# EAGLE design GearIndicator_disp (EAGLE 7.1.0)
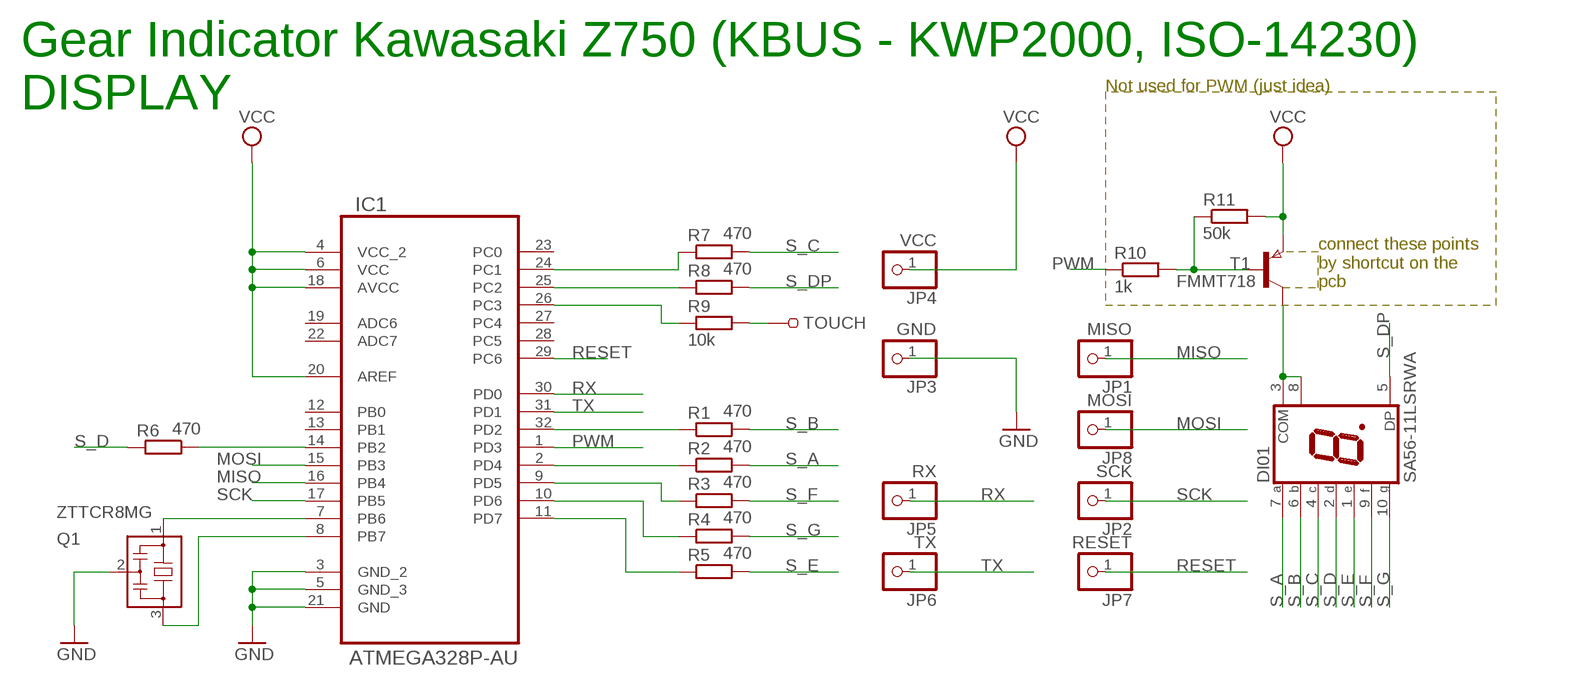
[diagram p0: schematic, sheet 1]

## Parts
DI01  SA56-11LSRWA  7-SEG_SA56-11  [SA56-11]
IC1  ATMEGA328P-AU  [QFP80P900X900X120-32N]
JP1  MISO  PIN1  [PIN1]
JP2  SCK  PIN1  [PIN1]
JP3  GND  PIN1  [PIN1]
JP4  VCC  PIN1  [PIN1]
JP5  RX  PIN1  [PIN1]
JP6  TX  PIN1  [PIN1]
JP7  RESET  PIN1  [PIN1]
JP8  MOSI  PIN1  [PIN1]
Q1  ZTTCR8MG  ZTTCR  [ZTTCR]
R1  470  R-EU_R0603  [R0603]
R2  470  R-EU_R0603  [R0603]
R3  470  R-EU_R0603  [R0603]
R4  470  R-EU_R0603  [R0603]
R5  470  R-EU_R0603  [R0603]
R6  470  R-EU_R0603  [R0603]
R7  470  R-EU_R0603  [R0603]
R8  470  R-EU_R0603  [R0603]
R9  10k  R-EU_R0603  [R0603]
R10  1k  R-EU_R0603  [R0603]
R11  50k  R-EU_R0603  [R0603]
T1  FMMT718  [SOT-23]
TOUCH  SMD1  [SMD_2X2]

## Nets
GND: IC1.3(GND_2) IC1.5(GND_3) IC1.21(GND) JP3.1 Q1.2
MISO: IC1.16(PB4) JP1.1
MOSI: IC1.15(PB3) JP8.1
N$1: IC1.7(PB6) Q1.1
N$2: IC1.8(PB7) Q1.3
N$3: DI01.3(COM) DI01.8(COM) T1.1(C)
N$4: IC1.24(PC1) R7.1
N$5: IC1.25(PC2) R8.1
N$6: IC1.11(PD7) R5.1
N$7: IC1.14(PB2) R6.1
N$8: IC1.32(PD2) R1.1
N$9: IC1.2(PD4) R2.1
N$10: IC1.9(PD5) R3.1
N$11: R10.2 R11.1 T1.3(B)
N$12: IC1.26(PC3) R9.1
N$13: R9.2 TOUCH.P$1
N$16: IC1.10(PD6) R4.1
PWM: IC1.1(PD3) R10.1
RESET: IC1.29(PC6) JP7.1
RX: IC1.30(PD0) JP5.1
S_A: DI01.7(A) R2.2
S_B: DI01.6(B) R1.2
S_C: DI01.4(C) R7.2
S_D: DI01.2(D) R6.2
S_DP: DI01.5(DP) R8.2
S_E: DI01.1(E) R5.2
S_F: DI01.9(F) R3.2
S_G: DI01.10(G) R4.2
SCK: IC1.17(PB5) JP2.1
TX: IC1.31(PD1) JP6.1
VCC: IC1.4(VCC_2) IC1.6(VCC) IC1.18(AVCC) IC1.20(AREF) JP4.1 R11.2 T1.2(E)
Unconnected: IC1.12(PB0) IC1.13(PB1) IC1.19(ADC6) IC1.22(ADC7) IC1.23(PC0) IC1.27(PC4) IC1.28(PC5)

## Notes on the sheet
- Not used for PWM (just idea)
- Gear Indicator Kawasaki Z750 (KBUS - KWP2000, ISO-14230)
  DISPLAY
- connect these points
  by shortcut on the
  pcb

## Library data of the parts
DI01 = display-kingbright:7-SEG_: Kingbright 14.2mm (0.56 INCH) SINGLE DIGIT NUMERIC DUISPLAY Source: SA56-11EWA(Ver1189471036.pdf; OC_FARNELL: unknown; OC_NEWARK: unknown
IC1 = Atmel_By_element14_Batch_1:ATMEGA328P-AU: 8-bit Microcontroller with In-System Programmable Flash; MPN: ATMEGA328P-AU; OC_FARNELL: 1715486; OC_NEWARK: 14R4631; PACKAGE: TQFP-32; SUPPLIER: Atmel
JP1-JP8 = pinhead:PIN1
Q1 = murata-filter:ZTTCR
R1-R11 = resistor:R-EU_: RESISTOR, European symbol
T1 = zetex:FMMT7*: PNP SILICON POWER (SWITCHING) TRANSISTORS SuperSOT Source: http://www.zetex.com/3.0/pdf/FMMT717.pdf; MPN: FMMT718; OC_FARNELL: 9526463RL; OC_NEWARK: 96K9968
TOUCH = pinhead:SMD1

## Board
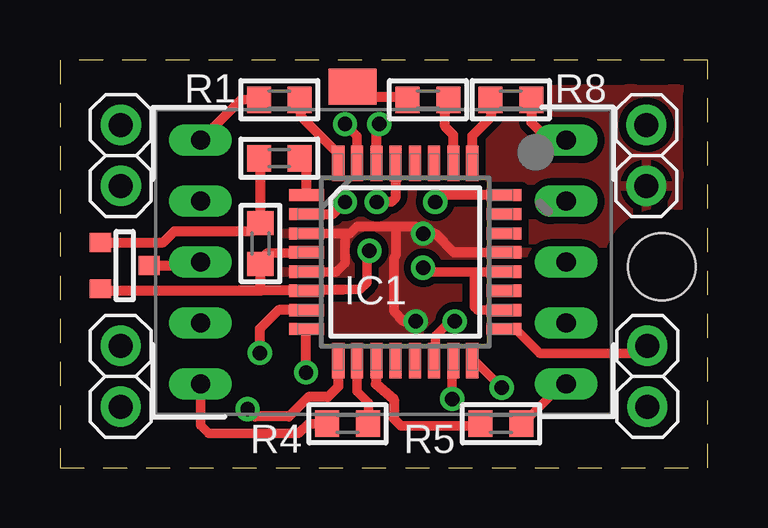
[diagram p1: board, top side]
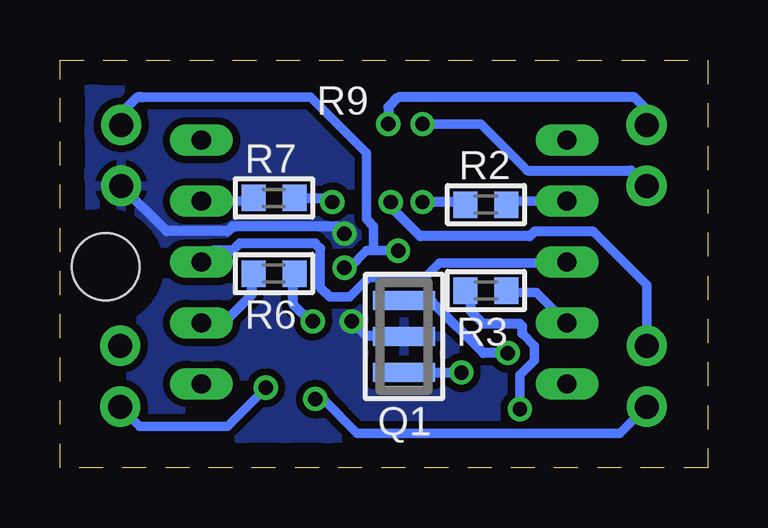
[diagram p2: board, bottom side, seen from below]

Size 27 x 17 mm. Coordinates in mm from the lower left corner, seen from the top.
Outline: 27,17 0,17 0,0 27,0 27,17
Copper layers (1*16): Top 0.035mm / dielectric 1.5mm / Bottom 0.035mm
Design rules "kawasaki": minimum track width 0.4mm, minimum drill 0.6mm, track to track 0.3mm, track to pad 0.3mm, pad to pad 0.3mm, via to via 0.3mm, smd to smd 0.3mm, copper to edge 40mil, drill to drill 8mil, minimum pad ring 10mil, minimum via ring 8mil, stop-mask expansion 4mil, vias tented up to drill 0mil, thermal gap 10mil
Holes 2.8 mm at 25.1,8.38

### Footprints (pad centres in the part's own frame; a part is rotated, then mirrored left to right if it is on the bottom)
SA56-11 = drill 0.8 long: 1 -5.08,-7.62; 2 -2.54,-7.62; 3 0,-7.62; 4 2.54,-7.62; 5 5.08,-7.62; 6 5.08,7.62; 7 2.54,7.62; 8 0,7.62; 9 -2.54,7.62; 10 -5.08,7.62
QFP80P900X900X120-32N = smd 1.473 x 0.508: 1 -4.115,2.794; 2 -4.115,2.007; 3 -4.115,1.194; 4 -4.115,0.406; 5 -4.115,-0.406; 6 -4.115,-1.194; 7 -4.115,-2.007; 8 -4.115,-2.794; 17 4.115,-2.794; 18 4.115,-2.007; 19 4.115,-1.194; 20 4.115,-0.406; 21 4.115,0.406; 22 4.115,1.194; 23 4.115,2.007; 24 4.115,2.794 | smd 0.508 x 1.473: 9 -2.794,-4.115; 10 -2.007,-4.115; 11 -1.194,-4.115; 12 -0.406,-4.115; 13 0.406,-4.115; 14 1.194,-4.115; 15 2.007,-4.115; 16 2.794,-4.115; 25 2.794,4.115; 26 2.007,4.115; 27 1.194,4.115; 28 0.406,4.115; 29 -0.406,4.115; 30 -1.194,4.115; 31 -2.007,4.115; 32 -2.794,4.115
PIN1 = drill 1 pad 1.676: 1 0,0
ZTTCR = smd 0.8 x 2.6: 1 -1.5,0; 2 0,0; 3 1.5,0
R0603 = smd 1 x 1.1: 1 -0.85,0; 2 0.85,0
SOT-23 = smd 0.787 x 0.889: 1 0.025,-1.016; 2 -0.94,1.016; 3 0.991,1.016
SMD_2X2 = smd 2 x 1.5: P$1 0,0

### Placement (x,y rotation side)
DI01  13.48,8.57 90 top
IC1  14.4,8.57 0 top
JP1  24.49,2.54 0 top
JP2  24.49,5.08 90 top
JP3  24.45,11.75 0 top
JP4  24.45,14.29 0 top
JP5  2.54,14.29 0 top
JP6  2.54,11.75 0 top
JP7  2.53,5.08 0 top
JP8  2.53,2.54 0 top
Q1  12.66,5.47 270 bottom
R1  9.14,15.34 180 top
R2  9.24,10.97 0 bottom
R3  9.24,7.38 0 bottom
R4  11.99,1.83 180 top
R5  18.39,1.83 0 top
R6  18.08,8.09 180 bottom
R7  18.08,11.25 180 bottom
R8  18.8,15.34 0 top
R9  15.34,15.34 180 top
R10  9.14,12.9 180 top
R11  8.36,9.35 270 top
T1  2.7,8.4 90 top
TOUCH  12.2,15.9 0 top

### Tracks (layer width: path | path; a pad name or v marks a point on that pad's centre or on a via)
GND  (via drill 0.6)
  Top 0.4: IC1.3 11.89,9.77 | 11.89,9.77 12.1,9.77 12.39,10.06 14.02,10.06 | IC1.5 11.52,8.17 11.89,8.53 11.89,9.77 | 14.02,10.06 14.83,10.06 v15.14,9.75 | IC1.21 17.34,8.98 | 14.02,10.06 14.02,8.84 13.92,8.74 13.92,6.5 14.33,6.1 v14.83,6.1
  Top 0.406: 18.47,8.94 IC1.21 | 10.29,9.75 IC1.3 | 17.34,8.98 16.42,8.98 15.65,9.75 v15.14,9.75
  Bottom 0.4: 12.67,5.49 13.61,5.49
  Bottom 0.406: 12.67,5.49 Q1.2 | v15.14,9.75 15.44,10.06 19.81,10.06 20.02,9.86 22.55,9.86 JP3.1 | 13.61,5.49 14.22,5.49 v14.83,6.1
  pour Top: 0.51,16.46 26.42,16.46 26.42,0.51 0.51,0.51
  pour Bottom: 0.51,16.46 26.42,16.46 26.42,0.51 0.51,0.51
MISO  (via drill 0.6)
  Top 0.4: v18.41,3.33 17.3,4.45 IC1.16
  Bottom 0.4: v18.41,3.33 20.02,1.73 23.68,1.73 JP1.1
MOSI  (via drill 0.6)
  Top 0.4: v16.35,2.86 16.35,4.45 IC1.15
  Bottom 0.4: v16.35,2.86 16.03,2.86 14.61,1.43 3.65,1.43 JP8.1
N$1  (via drill 0.6)
  Top 0.406: IC1.7 9.11,6.57 8.33,5.79 v8.33,4.78
  Bottom 0.406: v8.33,4.78 9.35,4.78 11.48,6.91 12.6,6.91 Q1.1
N$2  (via drill 0.6)
  Top 0.406: 10.27,5.79 IC1.8 10.26,5.76 v10.26,3.96
  Bottom 0.406: Q1.3 10.27,3.97 v10.26,3.96
N$3
  Top 0.406: T1.1 5.71,8.42 DI01.8
  Bottom 0.4: 16.15,9.14 16.15,7.52 15.75,7.11 14.94,7.11 14.12,7.92 11.79,7.92 11.18,8.53 5.9,8.53 DI01.8
  Bottom 0.406: 16.15,9.14 16.36,9.35 19.51,9.35 19.81,9.04 20.63,9.04 DI01.3
N$4  (via drill 0.6)
  Top 0.406: IC1.24 15.94,11.37 v15.65,11.07
  Bottom 0.406: R7.1 15.82,11.25 v15.65,11.07
N$5
  Top 0.406: IC1.25 17.19,13.84 17.98,14.63 17.98,15.3 R8.1
N$6
  Top 0.4: 14.21,1.75 17.46,1.75 R5.1 | 13.18,4.45 IC1.11
  Top 0.406: 13.18,4.45 13.18,3.49 13.92,2.85 13.92,2.04 14.21,1.75
N$7  (via drill 0.6)
  Top 0.4: v16.46,6.1 16.26,6.1 15.65,5.49 15.65,4.51 IC1.14
  Bottom 0.406: v16.46,6.1 16.56,6.1 17.27,6.81 17.27,8.15 R6.1
N$8
  Top 0.406: IC1.32 11.6,13.09 10.06,14.63 10.06,15.28 R1.1
N$9  (via drill 0.6)
  Top 0.406: IC1.2 11.39,10.58 v11.89,11.07
  Bottom 0.406: R2.1 9.98,10.77 10.29,11.07 v11.89,11.07
N$10  (via drill 0.6)
  Top 0.406: IC1.9 11.6,3.37 11.18,2.95 10.36,2.95 9.55,2.13 8.13,2.13 v7.82,2.44
  Bottom 0.4: v7.82,2.44 7.82,3.86 7.21,4.47 7.21,5.08 7.72,5.59
  Bottom 0.406: 7.72,5.59 7.72,5.89 7.82,5.99 9.35,5.99 9.86,6.5 9.86,7.14 R3.1
N$11
  Top 0.406: T1.3 4.31,9.39 4.78,9.86 8.02,9.86 R11.1 8.36,12.86 R10.2
N$12
  Top 0.406: IC1.26 16.4,13.88 16.05,14.22 16.05,15.3 R9.1
N$13
  Top 0.406: R9.2 14.39,15.44 12.5,15.44 12.2,15.74 TOUCH.P$1
N$16
  Top 0.4: R4.1 12.86,1.91 12.86,2.7 12.38,3.17 12.38,4.45 IC1.10
PWM
  Top 0.406: IC1.1 10.28,12.62 R10.1
RESET  (via drill 0.6)
  Top 0.406: IC1.29 13.99,11.25 13.82,11.07 v13.21,11.07
  Bottom 0.4: 4.76,9.84 2.54,7.62 JP7.1
  Bottom 0.406: 4.76,9.84 7.23,9.84 7.42,9.65 11.99,9.65 13.21,10.87 v13.21,11.07
RX  (via drill 0.6)
  Top 0.406: IC1.30 13.2,14.22 v13.31,14.33
  Bottom 0.406: JP5.1 2.54,14.94 3.05,15.44 12.9,15.44 13.31,15.04 v13.31,14.33
S_A
  Bottom 0.4: DI01.7 8.19,11.11 R2.2
S_B
  Top 0.406: R1.2 7.54,15.33 DI01.6
S_C
  Bottom 0.4: DI01.4 19.21,11.11 R7.2
S_D
  Bottom 0.406: DI01.2 20.18,6.03 19,7.21 19,8.12 R6.2 19,8.02
S_DP
  Top 0.406: R8.2 19.65,14.39 20.32,13.72 21.04,13.72 DI01.5
S_E
  Top 0.4: R5.2 19.37,1.91 20.95,3.49 DI01.1
S_F
  Bottom 0.4: R3.2 7.78,7.3 7.14,7.3 5.87,6.03 DI01.9
S_G
  Top 0.4: DI01.10 5.86,1.76 6.2,1.42 9.96,1.42 10.36,1.83 R4.2 11.18,1.83
SCK
  Top 0.4: IC1.17 18.57,5.71 19.05,5.71 20,4.76 24.17,4.76 JP2.1
TX  (via drill 0.6)
  Top 0.4: IC1.31 12.39,13.82 v11.89,14.33
  Bottom 0.4: v11.89,14.33 9.45,14.33 7.52,12.39
  Bottom 0.406: 7.52,12.39 3.19,12.39 JP6.1
VCC  (via drill 0.6)
  Top 0.4: 11.79,7.42 12.5,7.42 12.8,7.72 12.8,8.94 v12.9,9.04 | IC1.20 17.37,8.17 | 17.37,8.17 15.3,8.17 v15.14,8.33 | IC1.18 17.41,6.57 17.27,6.71 17.27,8.06 17.37,8.17 | IC1.4 10.24,8.94 8.64,8.94 8.36,8.66 R11.2
  Top 0.406: T1.2 1.86,7.38 7.24,7.38 8.37,7.38 | 8.37,7.38 R11.2 | 8.37,7.38 7.46,7.38 IC1.6 10.32,7.42 11.79,7.42
  Bottom 0.4: 23.57,15.44 16.56,15.44 14.22,13.11 14.22,10.36 13.92,10.06 13.92,9.04 | v15.14,8.33 14.94,8.33 14.22,9.04 13.92,9.04 | 13.92,9.04 v12.9,9.04
  Bottom 0.406: 23.57,15.44 23.77,15.44 24.38,14.83 24.38,14.35 JP4.1

### Text on the board
TEST: TEST | 30 | 32 | 25 | vcc | 31 | 24 | 2 | gnd | vcc | vcc | 14 | 17 | 9 | 29 | 11 | 15 | 10 | 16